# EAGLE design Power Sandwitch (EAGLE 7.3.0)
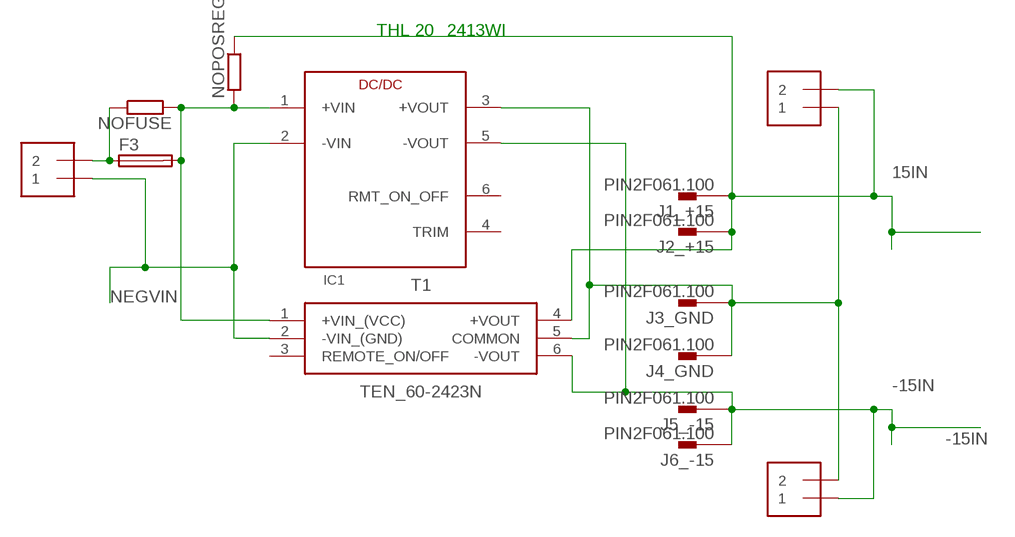
[diagram p0: schematic, sheet 1]

## Parts
DC_IN  1X2-3.5MM  [1X2-3.5MM]
DC_IN1  1X2-3.5MM  [1X2-3.5MM]
DC_IN2  1X2-3.5MM  [1X2-3.5MM]
F3  GSH15  [GSH15]
IC1  THL_20WI_SERIES  [THL_20WI_SERIES]
J1_+15  PIN2F061.100  [F061.100]
J2_+15  PIN2F061.100  [F061.100]
J3_GND  PIN2F061.100  [F061.100]
J4_GND  PIN2F061.100  [F061.100]
J5_-15  PIN2F061.100  [F061.100]
J6_-15  PIN2F061.100  [F061.100]
NOFUSE  SMT-REF  [SMT-REF]
NOPOSREG  SMT-REF  [SMT-REF]
T1  TEN_60-2423N  [TEN60-2423N]

## Nets
15IN: DC_IN1.2 J1_+15.A1 J1_+15.A2 J2_+15.A1 J2_+15.A2 NOPOSREG.1 T1.4(+VOUT)
-15IN: DC_IN2.1 IC1.5(-VOUT) J5_-15.A1 J5_-15.A2 J6_-15.A1 J6_-15.A2 T1.6(-VOUT)
N$1: DC_IN1.1 DC_IN2.2 IC1.3(+VOUT) J3_GND.A1 J3_GND.A2 J4_GND.A1 J4_GND.A2 T1.5(COMMON)
N$10: F3.2 IC1.1(+VIN) NOFUSE.2 NOPOSREG.2 T1.1(+VIN_(VCC))
N$11: DC_IN.2 F3.1 NOFUSE.1
NEGVIN: DC_IN.1 IC1.2(-VIN) T1.2(-VIN_(GND))
Unconnected: IC1.4(TRIM) IC1.6(RMT_ON_OFF) T1.3(REMOTE_ON/OFF)

## Notes on the sheet
- THL 20‑2413WI

## Library data of the parts
DC_IN DC_IN1 DC_IN2 = adafruit:1X2: 3.5mm Terminal block http://www.ladyada.net/library/pcb/eaglelibrary.html
F3 = fuse:GSH15: FUSE HOLDER grid 15mm, 19649 Wickmann; MPN: 64900001039; OC_FARNELL: 1271673; OC_NEWARK: 02P0318
IC1 = traco_thl_tel_series:THL_20WI_SERIES: TRACO POWER DC/DC converter THL 20WI Series created by Mario Blunk - electronics & IT engineering at www.train-z.de; HEAT-SINK: NO
J1_+15 J2_+15 J3_GND J4_GND J5_-15 J6_-15 = con-faston:PIN2: Flachstecker Typ Tyco/Electronics/AMP TAB, FASTON Printed Circuit Board Tabs Source: http://www.buerklin.com, http://catalog.tycoelectronics.com; OC_FARNELL: unknown; OC_NEWARK: unknown
NOFUSE NOPOSREG = resistor-shunt:SMT-REF: SMD SHUNT RESISTOR; OC_FARNELL: unknown; OC_NEWARK: unknown
T1 = TEN_60-2423N:TEN_60-2423N: TRACOPOWER 60W Isolated DC-DC Converter, Vin 18 36 V dc, Vout 15V dc, I/O isolation 1500V dc <https://componentsearchengine.com/Images/3/760517.jpg> Source: Datasheet <http://assets.tracopower.com/20161031120609/TEN60N/documents/ten60n-datasheet.pdf>; DESCRIPTION: TRACOPOWER 60W Isolated DC-DC Converter, Vin 18 36 V dc, Vout 15V dc, I/O isolation 1500V dc; HEIGHT: mm; MANUFACTURER_NAME: Traco Power; MANUFACTURER_PART_NUMBER: TEN 60-2423N; RS_PART_NUMBER: 7882705; SUPPLIER_NAME: RS

## Board
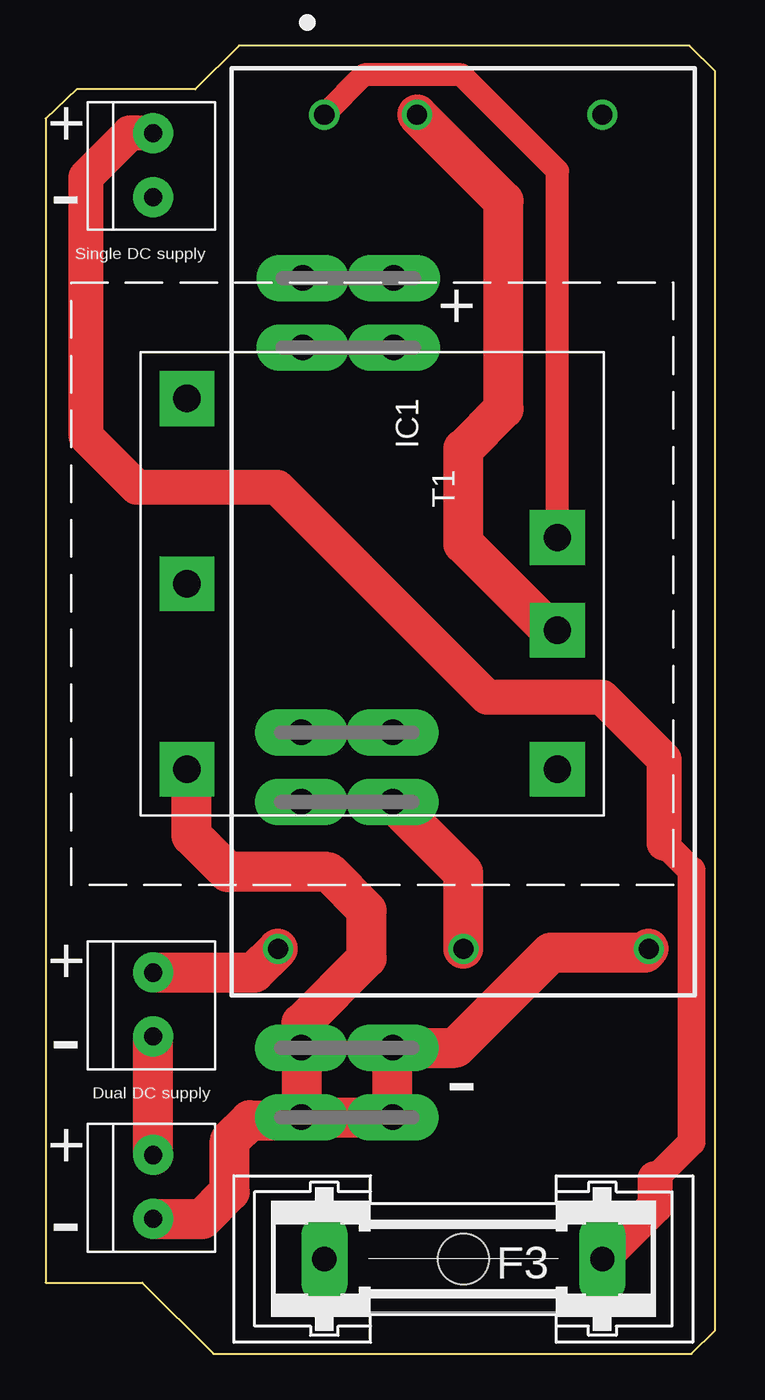
[diagram p1: board, top side]
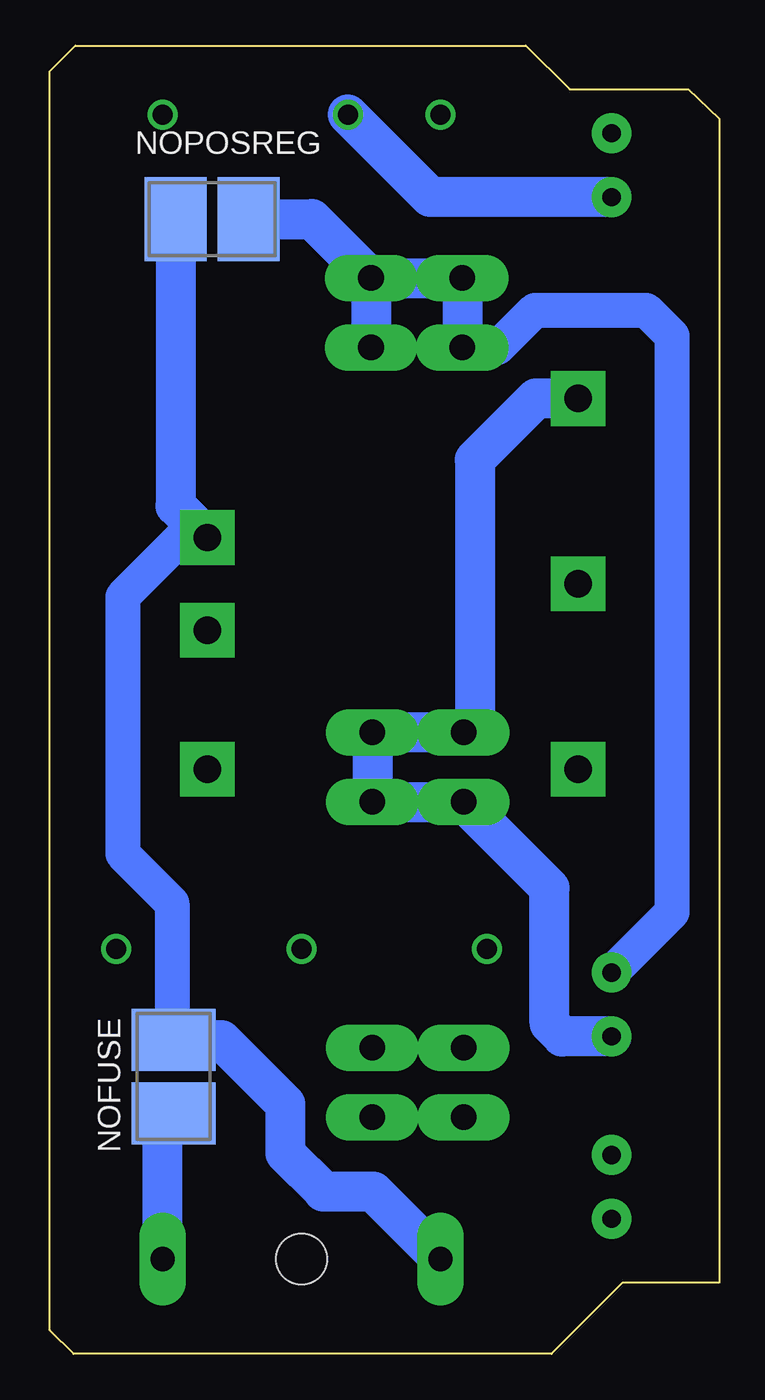
[diagram p2: board, bottom side, seen from below]

Size 36.7 x 71.7 mm. Coordinates in mm from the lower left corner, seen from the top.
Outline: 0,3.9 5.3,3.9 9.2,0 35.4,0 36.7,1.3 36.7,70.3 35.3,71.7 10.6,71.7 8.2,69.3 1.7,69.3 0,67.7 0,3.9
Copper layers (1*16): Top 0.035mm / dielectric 1.5mm / Bottom 0.035mm
Design rules "default": minimum track width 10mil, minimum drill 24mil, track to track 8mil, track to pad 8mil, pad to pad 8mil, via to via 8mil, smd to smd 8mil, copper to edge 40mil, drill to drill 8mil, minimum pad ring 10mil, minimum via ring 8mil, stop-mask expansion 4mil, vias tented up to drill 0mil, thermal gap 10mil

### Footprints (pad centres in the part's own frame; a part is rotated, then mirrored left to right if it is on the bottom)
1X2-3.5MM = drill 1 pad 2.184: 1 1.8,0; 2 -1.7,0
GSH15 = drill 1.321 pad 2.54 long: 1 -7.62,0; 2 7.62,0 | hole 2.794: 0,0
THL_20WI_SERIES = drill 1.5 pad 3 square: 1 -2.54,10.16; 2 2.54,10.16; 3 -10.16,-10.16; 4 0,-10.16; 5 10.16,-10.16; 6 10.16,10.16
F061.100 = drill 1.4 pad 2.54 long: A1 -2.5,0; A2 2.5,0
SMT-REF = smd 3.4 x 4.6: 1 2.007,0; 2 -2.007,0
TEN60-2423N = drill 1.1 pad 1.65: 1 -45.72,-7.62; 2 -45.72,-2.54; 3 -45.72,7.62; 4 0,-10.16; 5 0,0; 6 0,10.16

### Placement (x,y rotation side)
DC_IN  5.9,65.2 270 top
DC_IN1  5.9,19.2 270 top
DC_IN2  5.9,9.2 270 top
F3  22.9,5.2 180 top
IC1  17.9,42.2 270 top
J1_+15  16.59,58.96 180 top
J2_+15  16.59,55.15 180 top
J3_GND  16.52,34.06 180 top
J4_GND  16.52,30.25 180 top
J5_-15  16.52,16.78 180 top
J6_-15  16.52,12.97 180 top
NOFUSE  29.9,15.2 270 bottom
NOPOSREG  27.8,62.2 0 bottom
T1  22.9,22.2 270 top

### Tracks (layer width: path | path; a pad name or v marks a point on that pad's centre or on a via)
15IN
  Top 2.184: DC_IN1.2 11.44,20.9 T1.4
  Bottom 1.93: J2_+15.A2 12.15,55.15 10.1,57.2 4,57.2 2.6,55.8 2.6,24.2 DC_IN1.2
  Bottom 2.184: NOPOSREG.1 22.33,62.2 J1_+15.A1 | J1_+15.A1 J2_+15.A1 | J1_+15.A1 J1_+15.A2 J2_+15.A2
-15IN
  Top 2.184: DC_IN2.1 8.6,7.4 10.1,8.9 10.1,11.7 11.2,12.8 13.85,12.8 J6_-15.A2 | J6_-15.A2 J6_-15.A1 J5_-15.A1 22.48,16.78 27.7,22 32.86,22 T1.6 | J6_-15.A2 J5_-15.A2 14.02,18.12 17.6,21.7 17.6,24.3 15.5,26.4 10,26.4 8,28.4 8,31.78 IC1.5
N$1
  Top 2.184: DC_IN2.2 DC_IN1.1 | T1.5 22.9,26.37 J4_GND.A1
  Bottom 2.184: IC1.3 10.04,52.36 13.4,49 13.4,34.68 J3_GND.A2 J3_GND.A1 J4_GND.A1 J4_GND.A2 9.3,25.53 9.3,18.1 8.6,17.4 DC_IN1.1
N$10
  Top 1.27: IC1.1 28.06,64.84 22.8,70.1 17.46,70.1 T1.1
  Bottom 1.93: IC1.1 29.46,44.74 32.7,41.5 32.7,27.4 30,24.7 30,17.31 NOFUSE.2
  Bottom 2.184: NOFUSE.2 27.31,17.21 23.8,13.7 23.8,11 21.7,8.9 18.98,8.9 F3.2 | NOPOSREG.2 29.81,46.49 IC1.1
N$11
  Top 1.5: 33.9,28 35.4,26.5 | 35.4,11.6 33.4,9.6
  Top 1.53: 35.4,26.5 35.4,11.6
  Top 1.93: DC_IN.2 4.6,66.9 2.2,64.5 2.2,50.3 5,47.5 12.7,47.5 24.2,36 30.5,36 33.9,32.6 33.9,28 | 33.4,9.6 33.4,8.08 F3.1
  Bottom 2.184: F3.1 30.52,12.57 NOFUSE.1
NEGVIN
  Top 2.184: IC1.2 27.64,39.66 22.9,44.4 22.9,49.6 25.1,51.8 25.1,63.18 T1.2
  Bottom 2.184: DC_IN.1 15.84,63.4 T1.2

### Text on the board
tPlace: Single DC supply | Dual DC supply
tNames: + | - | + | + | - | - | + | -